# Altium project АСК_2.PrjPcb
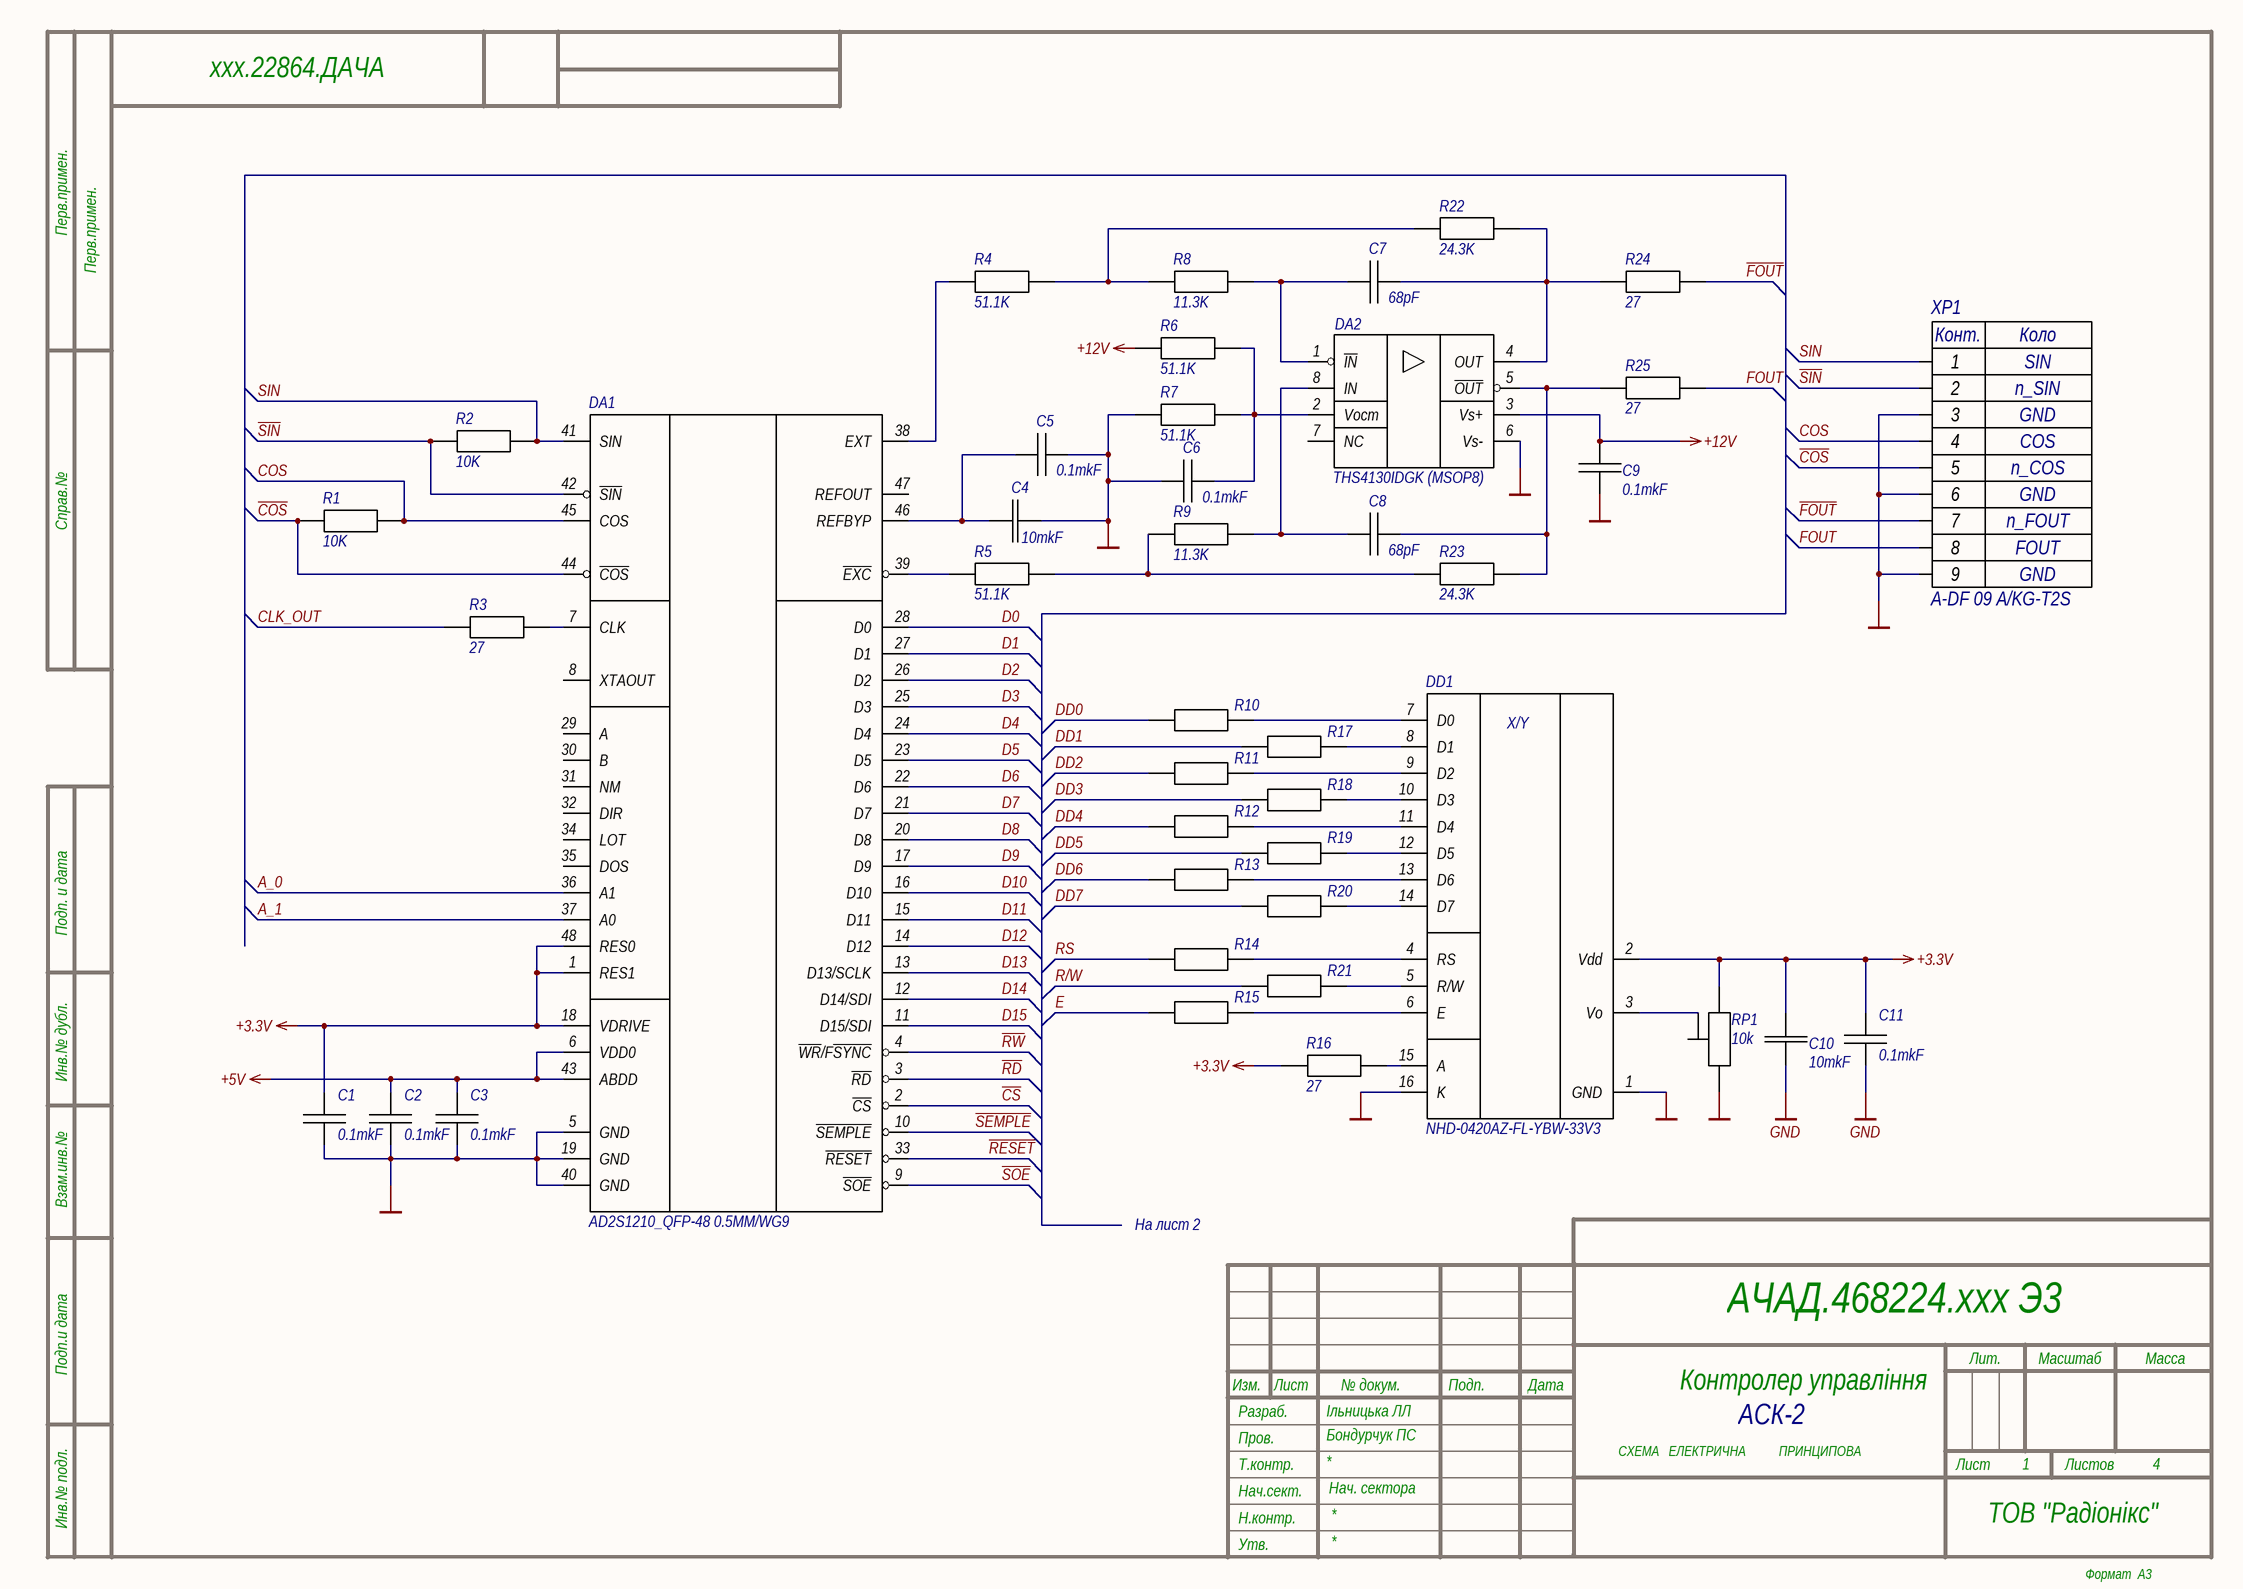
[diagram p0: Sheet1.SchDoc]
7 sheets, 214 parts. Net scope: global (net labels, ports and power ports of the same name join across sheets).
Sheets:
  Sheet1.SchDoc
  Sheet2.SchDoc
  Sheet3.SchDoc
  Sheet4.SchDoc
  ACK_2_Sheet6.SchDoc
  Sheet5.SchDoc
  ACR_2_Sheet7.SchDoc

## Sheet Sheet1.SchDoc
size 420 x 297 mm; CheckedBy: Бондурчук ПС; Author: Ільницька ЛЛ; CompanyName: ТОВ "Радіонікс"; SheetNumber: 1; SheetTotal: 4; DecimalNumber: АЧАД.468224.ххх Э3; HeadOfSector: Нач. сектора; MainDevice: Перв.примен.; Name: Контролер управління; DecimalNumber_MIRROR: ххх.22864.ДАЧА; ЕСКД_Децимальний_номер: АЧАД.468224.ххх Э3; ЕСКД_Назва_схеми_1: Схема електрична; ЕСКД_Назва_схеми_2: принципова; ЕСКД_Лист: 1; ЕСКД_Листів: 4; ЕСКД_Назва_пристрою_1: Система контроля; ЕСКД_Назва_пристрою_2: АСК-2; ЕСКД_Організація: ТОВ "Радіонікс"; PageSetup: Record=PageOptions|CenterHorizontal=True|CenterVertical=True|PrintScale=0.98|XCorrection=1.00|YCorrection=1.00|PrintKind=1|BorderSize=5000000|LeftOffset=0|BottomOffset=0|Orientation=2|PaperLength=1000|PaperWidth=1000|Scale=100|PaperSource=15|PrintQuality=1200|MediaType=1|DitherType=10|PrintScaleMode=1|PaperKind=A3|PaperIndex=8

### Parts
C1  0.1mkF  [C_0603]
C2  0.1mkF  [C_0603]
C3  0.1mkF  [C_0603]
C4  10mkF  [C_1206]
C5  0.1mkF  [C_0603]
C6  0.1mkF  [C_0603]
C7  68pF  [C_0603]
C8  68pF  [C_0603]
C9  0.1mkF  [C_0603]
C10  10mkF  [C_1206]
C11  0.1mkF  [C_0603]
DA1  AD2S1210_QFP-48 0.5MM/WG9  [QFP-48 0.5MM/WG9]
DA2  THS4130IDGK (MSOP8)  [THS4130IDGK(MSOP8)]
DD1  NHD-0420AZ-FL-YBW-33V3  [NHD-0420AZ-FL-YBW-33V3-ND]
R1  10K  [R_0603]
R2  10K  [R_0603]
R3  27  [R_0603]
R4  51.1K  [R_0603]
R5  51.1K  [R_0603]
R6  51.1K  [R_0603]
R7  51.1K  [R_0603]
R8  11.3K  [R_0603]
R9  11.3K  [R_0603]
R10  27  [R_0603]  (value not drawn)
R11  27  [R_0603]  (value not drawn)
R12  27  [R_0603]  (value not drawn)
R13  27  [R_0603]  (value not drawn)
R14  27  [R_0603]  (value not drawn)
R15  27  [R_0603]  (value not drawn)
R16  27  [R_1206]
R17  27  [R_0603]  (value not drawn)
R18  27  [R_0603]  (value not drawn)
R19  27  [R_0603]  (value not drawn)
R20  27  [R_0603]  (value not drawn)
R21  27  [R_0603]  (value not drawn)
R22  24.3K  [R_0603]
R23  24.3K  [R_0603]
R24  27  [R_0603]
R25  27  [R_0603]
RP1  10k  [RES_TRIMMER_3361P-1-103GLF]
XP1  A-DF 09 A/KG-T2S

### Nets
+3.3V: C1.2 C10.2 C11.2 DA1.1(RES1) DA1.18(VDRIVE) DA1.48(RES0) DD1.2(Vdd) R16.1 RP1.2
+5V: C2.2 C3.2 DA1.6(VDD0) DA1.43(ABDD)
+12V: C9.1 DA2.3(Vs+) R6.1
GND: C1.1 C2.1 C3.1 C4.2 C5.1 C6.2 C9.2 C10.1 C11.1 DA1.5(GND) DA1.19(GND) DA1.40(GND) DA2.6(Vs-) DD1.1(GND) DD1.16(K) R7.1 RP1.1 XP1.3 XP1.6 XP1.9
A_0: DA1.36(A1)
A_1: DA1.37(A0)
~{COS}: DA1.44(~{COS}) R1.2 XP1.5
~{CS}: DA1.2(~{CS})
CLK_OUT: R3.1
COS: DA1.45(COS) R1.1 XP1.4
D0: DA1.28(D0)
D1: DA1.27(D1)
D2: DA1.26(D2)
D3: DA1.25(D3)
D4: DA1.24(D4)
D5: DA1.23(D5)
D6: DA1.22(D6)
D7: DA1.21(D7)
D8: DA1.20(D8)
D9: DA1.17(D9)
D10: DA1.16(D10)
D11: DA1.15(D11)
D12: DA1.14(D12)
D13: DA1.13(D13/SCLK)
D14: DA1.12(D14/SDI)
D15: DA1.11(D15/SDI)
DD0: R10.1
DD1: R17.1
DD2: R11.1
DD3: R18.1
DD4: R12.1
DD5: R19.1
DD6: R13.1
DD7: R20.1
E: R15.1
~{FOUT}: R24.2 XP1.7
FOUT: R25.2 XP1.8
R/W: R21.1
~{RD}: DA1.3(~{RD})
~{RESET}: DA1.33(~{RESET})
~{RW}: DA1.4(~{WR}/F~{SYNC})
RS: R14.1
~{SEMPLE}: DA1.10(~{SEMPLE})
~{SIN}: DA1.42(~{SIN}) R2.1 XP1.2
~{SOE}: DA1.9(~{SOE})
SIN: DA1.41(SIN) R2.2 XP1.1
NetC4_1: C4.1 C5.2 DA1.46(REFBYP)
NetC6_1: C6.1 DA2.2(Vocm) R6.2 R7.2
NetC7_1: C7.1 DA2.4(OUT) R22.2 R24.1
NetC7_2: C7.2 DA2.1(~{IN}) R8.2
NetC8_1: C8.1 DA2.5(~{OUT}) R23.1 R25.1
NetC8_2: C8.2 DA2.8(IN) R9.2
NetDA1_7: DA1.7(CLK) R3.2
NetDA1_38: DA1.38(EXT) R4.1
NetDA1_39: DA1.39(~{EXC}) R5.1
NetDD1_3: DD1.3(Vo) RP1.3
NetDD1_4: DD1.4(RS) R14.2
NetDD1_5: DD1.5(R/W) R21.2
NetDD1_6: DD1.6(E) R15.2
NetDD1_7: DD1.7(D0) R10.2
NetDD1_8: DD1.8(D1) R17.2
NetDD1_9: DD1.9(D2) R11.2
NetDD1_10: DD1.10(D3) R18.2
NetDD1_11: DD1.11(D4) R12.2
NetDD1_12: DD1.12(D5) R19.2
NetDD1_13: DD1.13(D6) R13.2
NetDD1_14: DD1.14(D7) R20.2
NetDD1_15: DD1.15(A) R16.2
NetR4_2: R4.2 R8.1 R22.1
NetR5_2: R5.2 R9.1 R23.2

Not connected (* = marked no-connect by the designer): DA1 8(XTAOUT) 29(A) 30(B) 31(NM) 32(DIR) 34(LOT) 35(DOS) 47(REFOUT); DA2 7(NC)

### Notes on the sheet
- SIN
- n_SIN
- COS
- n_COS
- GND
- n_FOUT
- FOUT
- На лист 2
- АСК-2
- Перв.примен.
- Справ.№
- Подп. и дата
- Инв.№ дубл.
- Взам.инв.№
- Подп.и дата
- Разраб.
- Изм.
- Лист
- № докум.
- Подп.
- Дата
- Лит.
- Масштаб
- Масса
- Т.контр.
- Пров.
- СХЕМА   ЕЛЕКТРИЧНА
- ПРИНЦИПОВА
- Листов
- Инв.№ подл.
- Утв.
- Н.контр.
- Нач.сект.
- Формат  A3
- (in symbol A-DF 09 A/KG-T2S) Конт.; Коло
- (in symbol NHD-0420AZ-FL-YBW-33V3) X/Y

### Library data of the parts
C1-C3 C5-C9 C11 = C_0.1mkF_0603
  C1-C3 C5 C6 C9 C11: Value: 0.1mkF
  C7 C8: Value: 68pF
C4 C10 = C_10mkF_1206: Value: 10mkF
R1-R15 R17-R25 = R_100_0603
  R1 R2: Value: 10K
  R3 R10-R15 R17-R21 R24 R25: Value: 27
  R4-R7: Value: 51.1K
  R8 R9: Value: 11.3K
  R22 R23: Value: 24.3K
R16 = R_10_1206: Value: 27
RP1 = R_10k_RES_TRIMMER: R_10k_RES_TRIMMER_3361P-1-103GLF; Value: 10k
DA1 = AD2S1210_QFP-48 0.5MM/WG9: Case: QFP-48 0.5MM/WG9

## Sheet Sheet2.SchDoc
size 420 x 297 mm; SheetNumber: 2; PageSetup: Record=PageOptions|CenterHorizontal=True|CenterVertical=True|PrintScale=0.49|XCorrection=1.00|YCorrection=1.00|PrintKind=1|BorderSize=5000000|LeftOffset=0|BottomOffset=0|Orientation=2|PaperLength=1000|PaperWidth=1000|Scale=100|PaperSource=7|PrintQuality=-4|MediaType=1|DitherType=10|PrintScaleMode=1|PaperKind=A4; DecimalNumber: АЧАД.468224.ххх Э3; HeadOfSector: Нач. сектора; MainDevice: Перв.примен.; Name: Наименование; DecimalNumber_MIRROR: Э3 ххх.422.864.ДАЧА
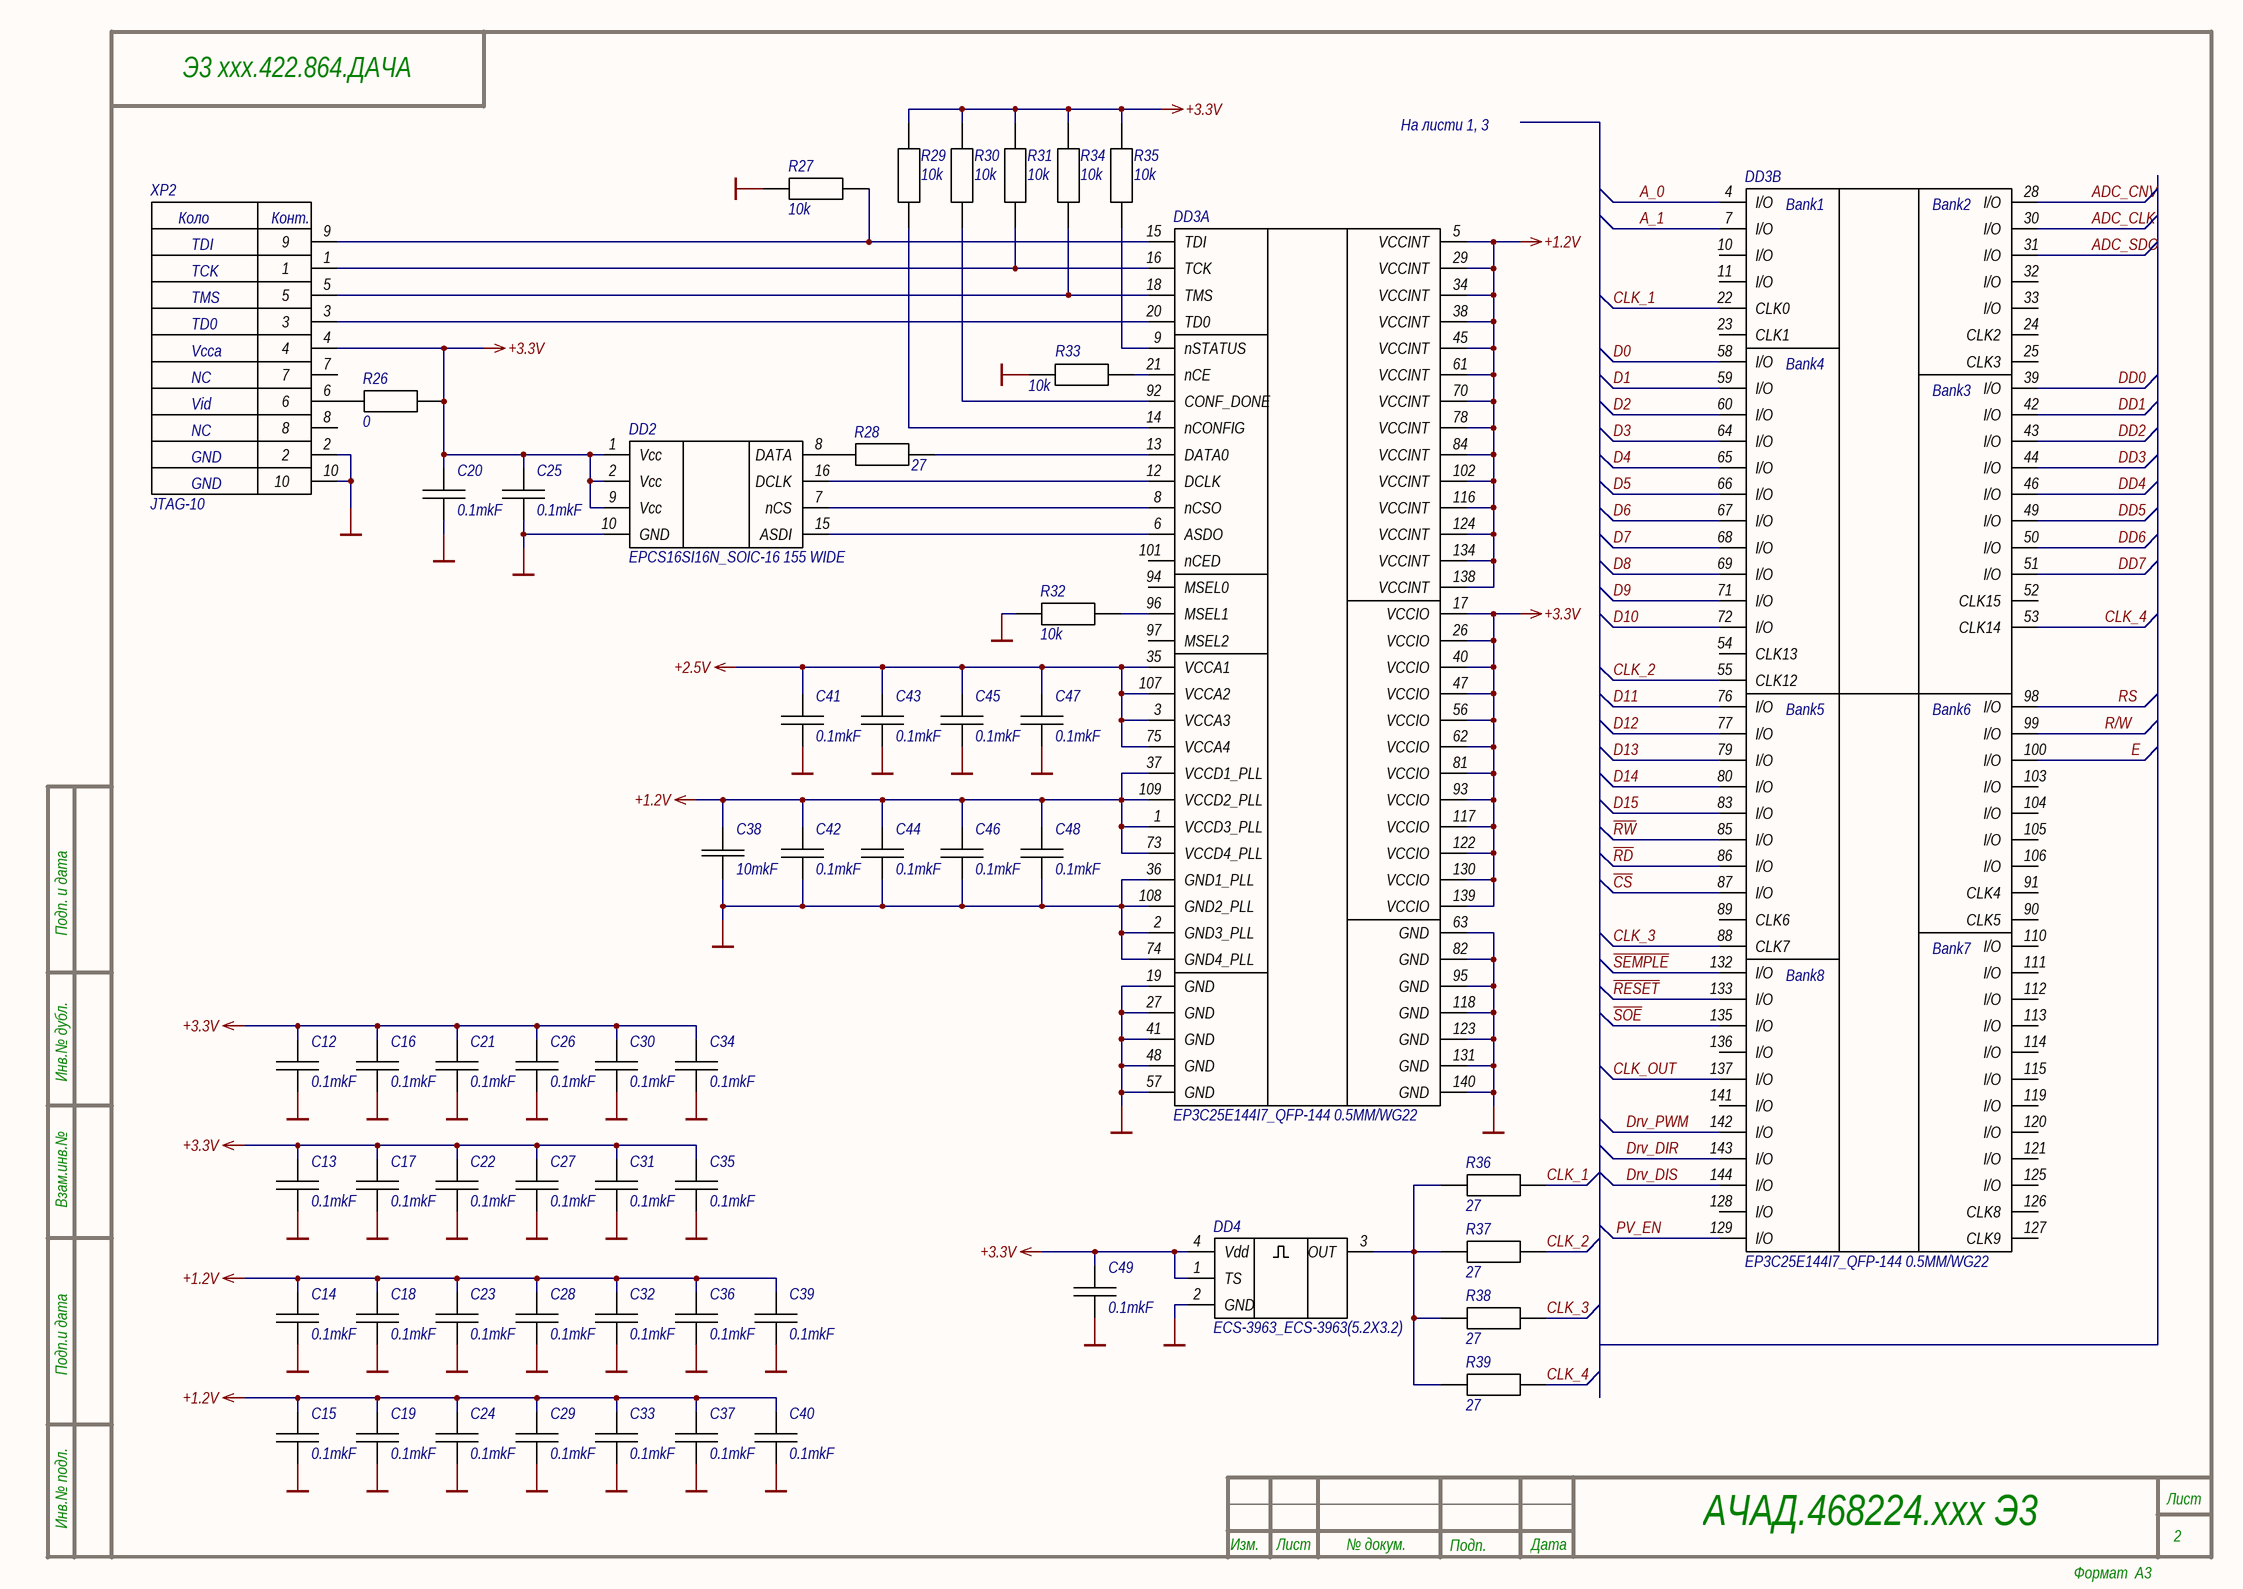
[diagram p1: Sheet2.SchDoc]

### Parts
C12  0.1mkF  [C_0603]
C13  0.1mkF  [C_0603]
C14  0.1mkF  [C_0603]
C15  0.1mkF  [C_0603]
C16  0.1mkF  [C_0603]
C17  0.1mkF  [C_0603]
C18  0.1mkF  [C_0603]
C19  0.1mkF  [C_0603]
C20  0.1mkF  [C_0603]
C21  0.1mkF  [C_0603]
C22  0.1mkF  [C_0603]
C23  0.1mkF  [C_0603]
C24  0.1mkF  [C_0603]
C25  0.1mkF  [C_0603]
C26  0.1mkF  [C_0603]
C27  0.1mkF  [C_0603]
C28  0.1mkF  [C_0603]
C29  0.1mkF  [C_0603]
C30  0.1mkF  [C_0603]
C31  0.1mkF  [C_0603]
C32  0.1mkF  [C_0603]
C33  0.1mkF  [C_0603]
C34  0.1mkF  [C_0603]
C35  0.1mkF  [C_0603]
C36  0.1mkF  [C_0603]
C37  0.1mkF  [C_0603]
C38  10mkF  [C_1206]
C39  0.1mkF  [C_0603]
C40  0.1mkF  [C_0603]
C41  0.1mkF  [C_0603]
C42  0.1mkF  [C_0603]
C43  0.1mkF  [C_0603]
C44  0.1mkF  [C_0603]
C45  0.1mkF  [C_0603]
C46  0.1mkF  [C_0603]
C47  0.1mkF  [C_0603]
C48  0.1mkF  [C_0603]
C49  0.1mkF  [C_0603]
DD2  EPCS16SI16N_SOIC-16 155 WIDE  [SOIC127P600X175-16N]
DD3  EP3C25E144I7_QFP-144 0.5MM/WG22  [QFP65P3122X3122X395-144N]  (parts A,B of 2)
DD4  ECS-3963_ECS-3963(5.2X3.2)  [ECS-3961]
R26  0  [R_1206]
R27  10k  [R_0603]
R28  27  [R_1206]
R29  10k  [R_0603]
R30  10k  [R_0603]
R31  10k  [R_0603]
R32  10k  [R_0603]
R33  10k  [R_0603]
R34  10k  [R_0603]
R35  10k  [R_0603]
R36  27  [R_0603]
R37  27  [R_0603]
R38  27  [R_0603]
R39  27  [R_0603]
XP2  JTAG-10

### Nets
+1.2V: C14.2 C15.2 C18.2 C19.2 C23.2 C24.2 C28.2 C29.2 C32.2 C33.2 C36.2 C37.2 C38.2 C39.2 C40.2 C42.2 C44.2 C46.2 C48.2 DD3.1(VCCD3_PLL) DD3.5(VCCINT) DD3.29(VCCINT) DD3.34(VCCINT) DD3.37(VCCD1_PLL) DD3.38(VCCINT) DD3.45(VCCINT) DD3.61(VCCINT) DD3.70(VCCINT) DD3.73(VCCD4_PLL) DD3.78(VCCINT) DD3.84(VCCINT) DD3.102(VCCINT) DD3.109(VCCD2_PLL) DD3.116(VCCINT) DD3.124(VCCINT) DD3.134(VCCINT) DD3.138(VCCINT)
+2.5V: C41.2 C43.2 C45.2 C47.2 DD3.3(VCCA3) DD3.35(VCCA1) DD3.75(VCCA4) DD3.107(VCCA2)
+3.3V: C12.2 C13.2 C16.2 C17.2 C20.2 C21.2 C22.2 C25.2 C26.2 C27.2 C30.2 C31.2 C34.2 C35.2 C49.2 DD2.1(Vcc) DD2.2(Vcc) DD2.9(Vcc) DD3.17(VCCIO) DD3.26(VCCIO) DD3.40(VCCIO) DD3.47(VCCIO) DD3.56(VCCIO) DD3.62(VCCIO) DD3.81(VCCIO) DD3.93(VCCIO) DD3.117(VCCIO) DD3.122(VCCIO) DD3.130(VCCIO) DD3.139(VCCIO) DD4.1(TS) DD4.4(Vdd) R26.1 R29.2 R30.2 R31.2 R34.2 R35.2 XP2.4
GND: C12.1 C13.1 C14.1 C15.1 C16.1 C17.1 C18.1 C19.1 C20.1 C21.1 C22.1 C23.1 C24.1 C25.1 C26.1 C27.1 C28.1 C29.1 C30.1 C31.1 C32.1 C33.1 C34.1 C35.1 C36.1 C37.1 C38.1 C39.1 C40.1 C41.1 C42.1 C43.1 C44.1 C45.1 C46.1 C47.1 C48.1 C49.1 DD2.10(GND) DD3.2(GND3_PLL) DD3.19(GND) DD3.27(GND) DD3.36(GND1_PLL) DD3.41(GND) DD3.48(GND) DD3.57(GND) DD3.63(GND) DD3.74(GND4_PLL) DD3.82(GND) DD3.95(GND) DD3.108(GND2_PLL) DD3.118(GND) DD3.123(GND) DD3.131(GND) DD3.140(GND) DD4.2(GND) R27.1 R32.1 R33.1 XP2.2 XP2.10
PV_EN: DD3.129(I/O)
A_0: DD3.4(I/O)
A_1: DD3.7(I/O)
ADC_CLK: DD3.30(I/O)
ADC_CNV: DD3.28(I/O)
ADC_SDO: DD3.31(I/O)
~{CS}: DD3.87(I/O)
CLK_1: DD3.22(CLK0) R36.2
CLK_2: DD3.55(CLK12) R37.2
CLK_3: DD3.88(CLK7) R38.2
CLK_4: DD3.53(CLK14) R39.2
CLK_OUT: DD3.137(I/O)
D0: DD3.58(I/O)
D1: DD3.59(I/O)
D2: DD3.60(I/O)
D3: DD3.64(I/O)
D4: DD3.65(I/O)
D5: DD3.66(I/O)
D6: DD3.67(I/O)
D7: DD3.68(I/O)
D8: DD3.69(I/O)
D9: DD3.71(I/O)
D10: DD3.72(I/O)
D11: DD3.76(I/O)
D12: DD3.77(I/O)
D13: DD3.79(I/O)
D14: DD3.80(I/O)
D15: DD3.83(I/O)
DD0: DD3.39(I/O)
DD1: DD3.42(I/O)
DD2: DD3.43(I/O)
DD3: DD3.44(I/O)
DD4: DD3.46(I/O)
DD5: DD3.49(I/O)
DD6: DD3.50(I/O)
DD7: DD3.51(I/O)
Drv_DIR: DD3.143(I/O)
Drv_DIS: DD3.144(I/O)
Drv_PWM: DD3.142(I/O)
E: DD3.100(I/O)
R/W: DD3.99(I/O)
~{RD}: DD3.86(I/O)
~{RESET}: DD3.133(I/O)
~{RW}: DD3.85(I/O)
RS: DD3.98(I/O)
~{SEMPLE}: DD3.132(I/O)
~{SOE}: DD3.135(I/O)
NetDD2_7: DD2.7(nCS) DD3.8(nCSO)
NetDD2_8: DD2.8(DATA) R28.1
NetDD2_15: DD2.15(ASDI) DD3.6(ASDO)
NetDD2_16: DD2.16(DCLK) DD3.12(DCLK)
NetDD3_9: DD3.9(nSTATUS) R35.1
NetDD3_13: DD3.13(DATA0) R28.2
NetDD3_14: DD3.14(nCONFIG) R29.1
NetDD3_15: DD3.15(TDI) R27.2 XP2.9
NetDD3_16: DD3.16(TCK) R31.1 XP2.1
NetDD3_18: DD3.18(TMS) R34.1 XP2.5
NetDD3_20: DD3.20(TD0) XP2.3
NetDD3_21: DD3.21(nCE) R33.2
NetDD3_92: DD3.92(CONF_DONE) R30.1
NetDD3_96: DD3.96(MSEL1) R32.2
NetDD4_3: DD4.3(OUT) R36.1 R37.1 R38.1 R39.1
NetR26_2: R26.2 XP2.6

Not connected (* = marked no-connect by the designer): DD3 10(I/O) 11(I/O) 23(CLK1) 24(CLK2) 25(CLK3) 32(I/O) 33(I/O) 52(CLK15) 54(CLK13) 89(CLK6) 90(CLK5) 91(CLK4) 94(MSEL0) 97(MSEL2) 101(nCED) 103(I/O) 104(I/O) 105(I/O) 106(I/O) 110(I/O) 111(I/O) 112(I/O) 113(I/O) 114(I/O) 115(I/O) 119(I/O) 120(I/O) 121(I/O) 125(I/O) 126(CLK8) 127(CLK9) 128(I/O) 136(I/O) 141(I/O); XP2 7 8

### Notes on the sheet
- На листи 1, 3
- Подп. и дата
- Инв.№ дубл.
- Взам.инв.№
- Подп.и дата
- Инв.№ подл.
- Изм.
- Лист
- № докум.
- Подп.
- Дата
- Формат  A3
- (in symbol EP3C25E144I7_QFP-144 0.5MM/WG22, part B) Bank1; Bank2; Bank4; Bank3; Bank5; Bank6; Bank7; Bank8
- (in symbol JTAG-10) Коло; Конт.; TDI; TCK; TMS; TD0; Vcca; NC; Vid; GND

### Library data of the parts
C12-C37 C39-C49 = C_0.1mkF_0603: Value: 0.1mkF
C38 = C_10mkF_1206: Value: 10mkF
R26 R28 = R_10_1206
  R26: Value: 0
  R28: Value: 27
R27 R29-R39 = R_10k_0603
  R27 R29-R35: Value: 10k
  R36-R39: Value: 27

## Sheet Sheet3.SchDoc
size 420 x 297 mm; SheetNumber: 3; ЕСКД_Децимальний_номер: ААЭД.468224.ххх Э3; ЕСКД_Лист: 3; PageSetup: Record=PageOptions|CenterHorizontal=True|CenterVertical=True|PrintScale=0.70|XCorrection=1.00|YCorrection=1.00|PrintKind=1|BorderSize=5000000|LeftOffset=0|BottomOffset=0|Orientation=2|PaperLength=1000|PaperWidth=1000|Scale=100|PaperSource=7|PrintQuality=600|MediaType=1|DitherType=10|PrintScaleMode=1|PaperKind=A4|PaperIndex=9; DecimalNumber: АЧАД.468224.ххх Э3; HeadOfSector: Нач. сектора; MainDevice: Перв.примен.; Name: Наименование; DecimalNumber_MIRROR: 3Э ххх.422864.ДАЧА
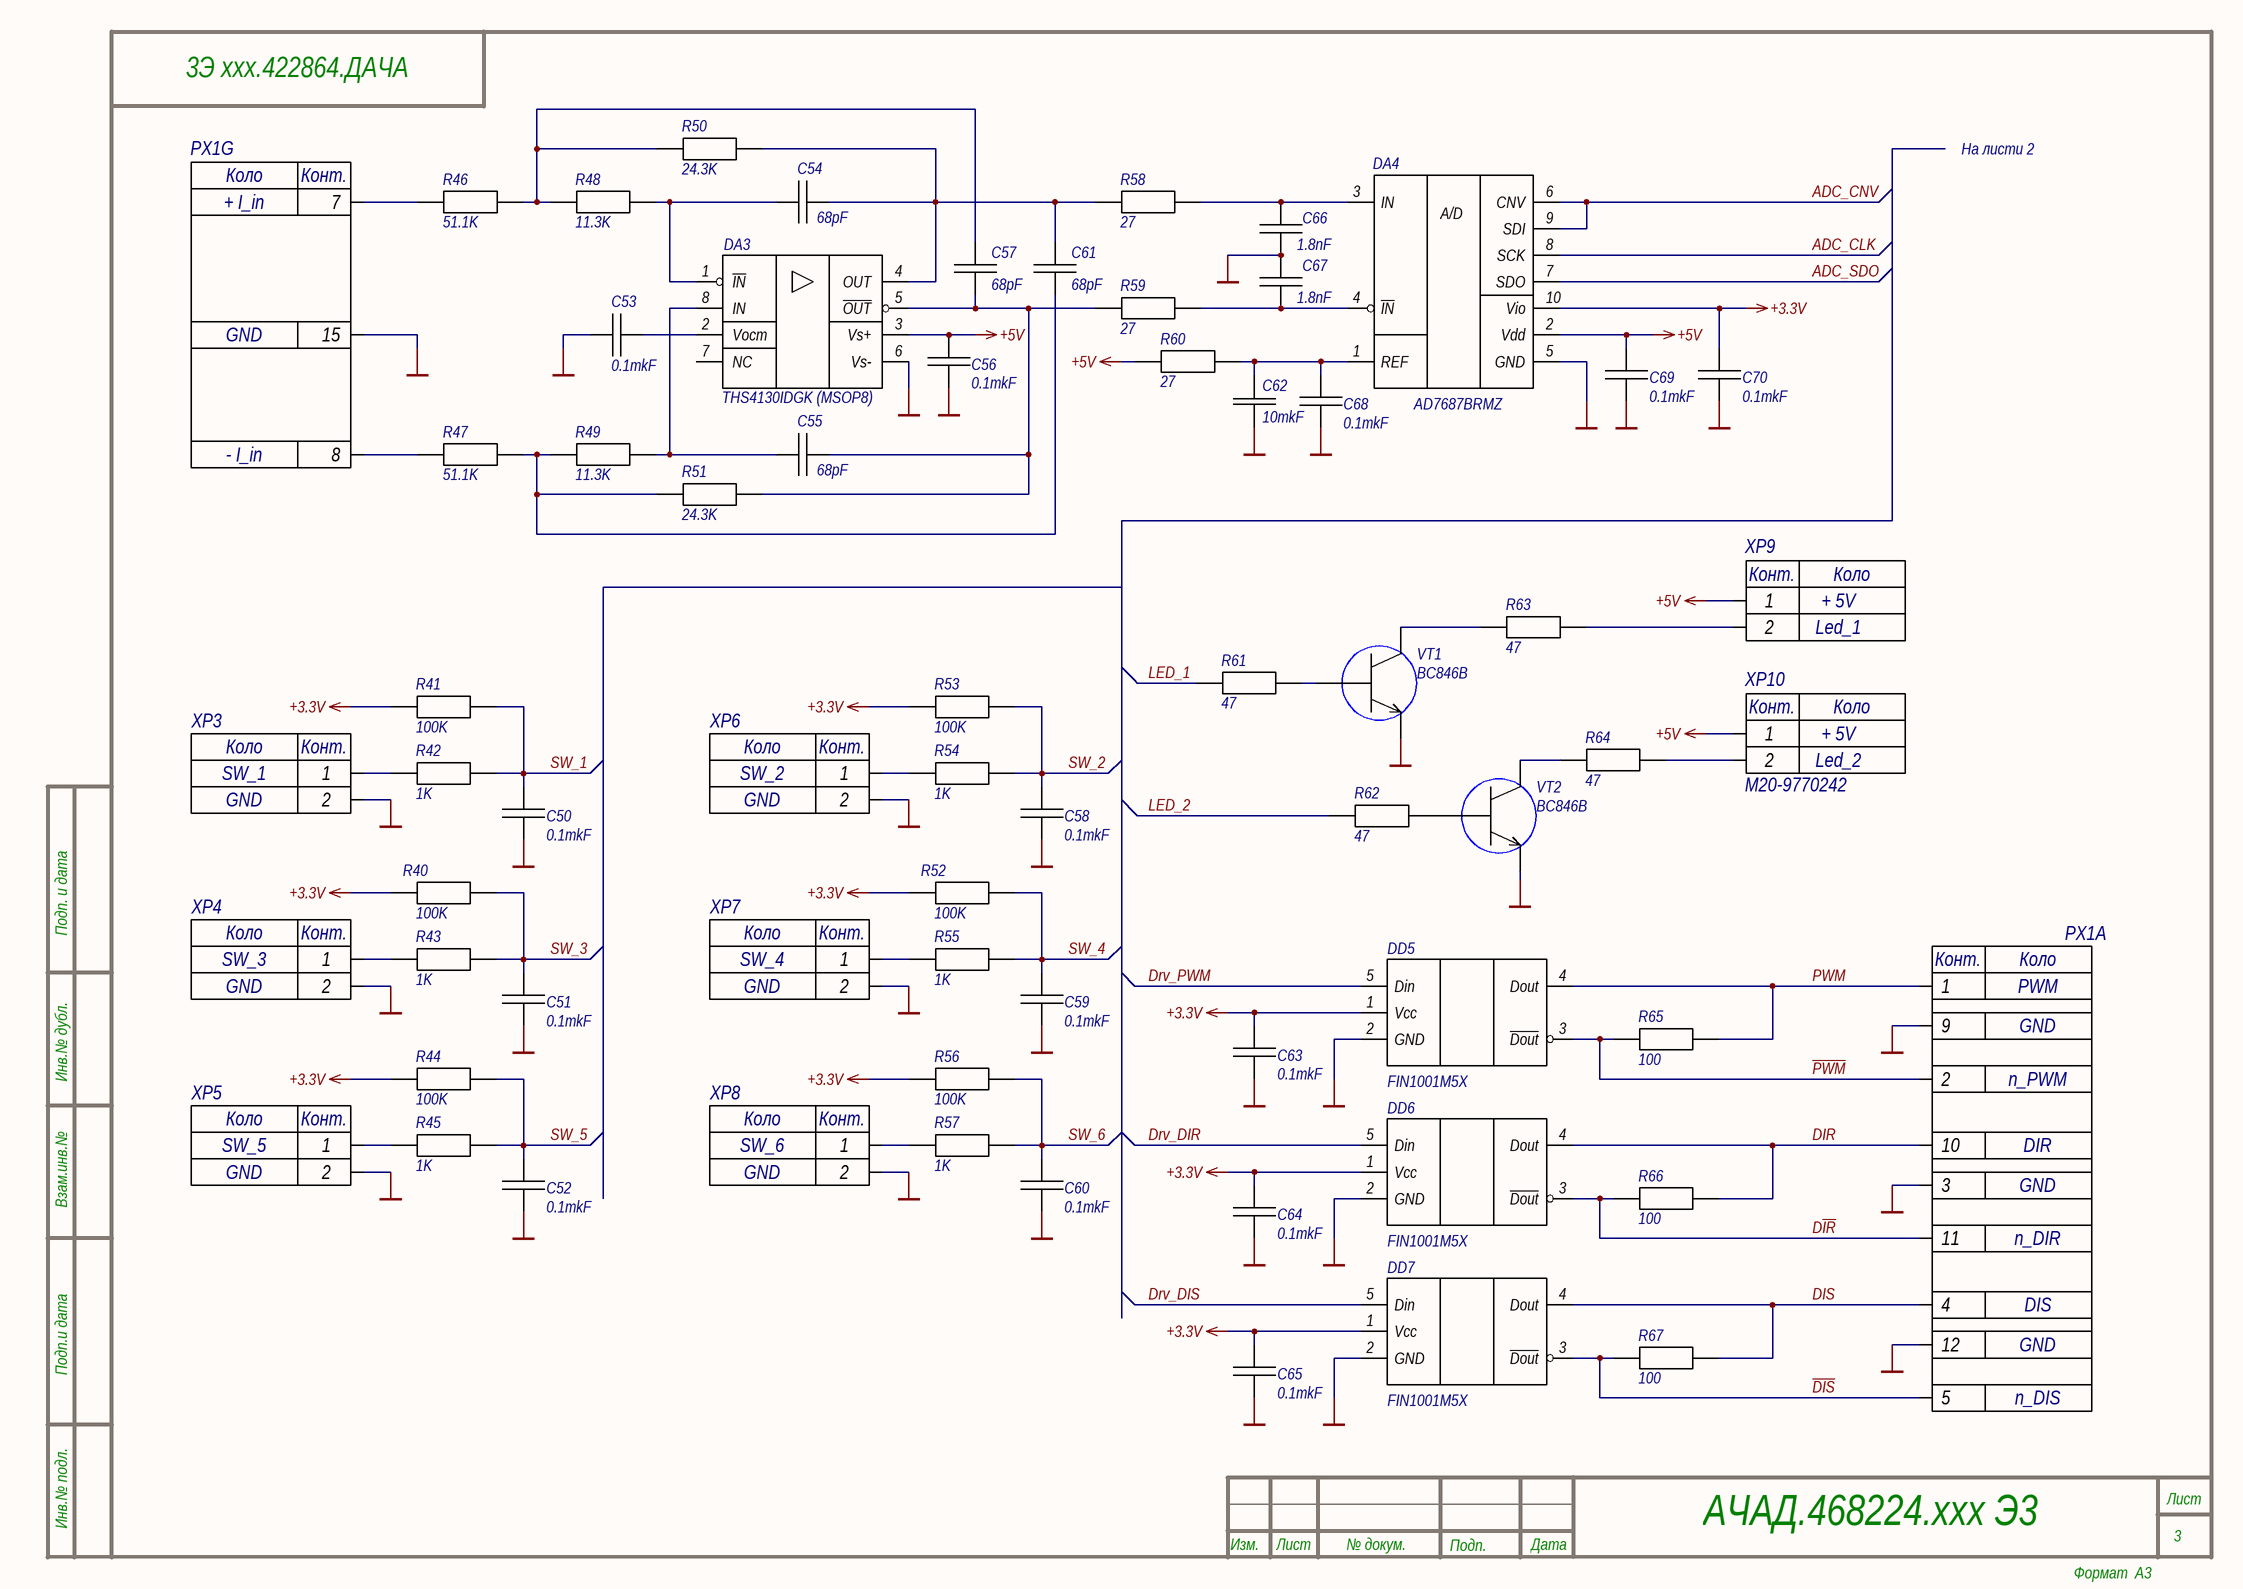
[diagram p2: Sheet3.SchDoc]

### Parts
C50  0.1mkF  [C_0603]
C51  0.1mkF  [C_0603]
C52  0.1mkF  [C_0603]
C53  0.1mkF  [C_0603]
C54  68pF  [C_0603]
C55  68pF  [C_0603]
C56  0.1mkF  [C_0603]
C57  68pF  [C_0603]
C58  0.1mkF  [C_0603]
C59  0.1mkF  [C_0603]
C60  0.1mkF  [C_0603]
C61  68pF  [C_0603]
C62  10mkF  [C_1206]
C63  0.1mkF  [C_0603]
C64  0.1mkF  [C_0603]
C65  0.1mkF  [C_0603]
C66  1.8nF  [C_0603]
C67  1.8nF  [C_0603]
C68  0.1mkF  [C_0603]
C69  0.1mkF  [C_0603]
C70  0.1mkF  [C_0603]
DA3  THS4130IDGK (MSOP8)  [THS4130IDGK(MSOP8)]
DA4  AD7687BRMZ
DD5  FIN1001M5X
DD6  FIN1001M5X
DD7  FIN1001M5X
PX1  DB_15  (value not drawn)  (parts A,B,C,D,E,G,H,I,J,K,L,O of 15)
R40  100K  [R_0603]
R41  100K  [R_0603]
R42  1K  [R_0603]
R43  1K  [R_0603]
R44  100K  [R_0603]
R45  1K  [R_0603]
R46  51.1K  [R_0603]
R47  51.1K  [R_0603]
R48  11.3K  [R_0603]
R49  11.3K  [R_0603]
R50  24.3K  [R_0603]
R51  24.3K  [R_0603]
R52  100K  [R_0603]
R53  100K  [R_0603]
R54  1K  [R_0603]
R55  1K  [R_0603]
R56  100K  [R_0603]
R57  1K  [R_0603]
R58  27  [R_0603]
R59  27  [R_0603]
R60  27  [R_0603]
R61  47  [R_0603]
R62  47  [R_0603]
R63  47  [R_0603]
R64  47  [R_0603]
R65  100  [R_0603]
R66  100  [R_0603]
R67  100  [R_0603]
VT1  BC846B  [SOT95P245X110 3N]
VT2  BC846B  [SOT95P245X110 3N]
XP3  M20-9770242  (value not drawn)
XP4  M20-9770242  (value not drawn)
XP5  M20-9770242  (value not drawn)
XP6  M20-9770242  (value not drawn)
XP7  M20-9770242  (value not drawn)
XP8  M20-9770242  (value not drawn)
XP9  M20-9770242  (value not drawn)
XP10  M20-9770242

### Nets
+3.3V: C63.1 C64.1 C65.1 C70.1 DA4.10(Vio) DD5.1(Vcc) DD6.1(Vcc) DD7.1(Vcc) R40.1 R41.1 R44.1 R52.1 R53.1 R56.1
+5V: C56.1 C69.1 DA3.3(Vs+) DA4.2(Vdd) R60.1 XP9.1 XP10.1
GND: C50.2 C51.2 C52.2 C53.1 C56.2 C58.2 C59.2 C60.2 C62.1 C63.2 C64.2 C65.2 C66.2 C67.1 C68.2 C69.2 C70.2 DA3.6(Vs-) DA4.5(GND) DD5.2(GND) DD6.2(GND) DD7.2(GND) PX1.3 PX1.9 PX1.12 PX1.15 VT1.2 VT2.2 XP3.2 XP4.2 XP5.2 XP6.2 XP7.2 XP8.2
ADC_CLK: DA4.8(SCK)
ADC_CNV: DA4.6(CNV) DA4.9(SDI)
ADC_SDO: DA4.7(SDO)
~{DIS}: DD7.3(~{Dout}) PX1.5 R67.1
D~{I}~{R}: DD6.3(~{Dout}) PX1.11 R66.1
DIR: DD6.4(Dout) PX1.10 R66.2
DIS: DD7.4(Dout) PX1.4 R67.2
Drv_DIR: DD6.5(Din)
Drv_DIS: DD7.5(Din)
Drv_PWM: DD5.5(Din)
LED_1: R61.1
LED_2: R62.1
~{PWM}: DD5.3(~{Dout}) PX1.1(2) R65.1
PWM: DD5.4(Dout) PX1.1 R65.2
SW_1: C50.1 R41.2 R42.2
SW_2: C58.1 R53.2 R54.2
SW_3: C51.1 R40.2 R43.2
SW_4: C59.1 R52.2 R55.2
SW_5: C52.1 R44.2 R45.2
SW_6: C60.1 R56.2 R57.2
NetC53_2: C53.2 DA3.2(Vocm)
NetC54_1: C54.1 C61.1 DA3.4(OUT) R50.2 R58.1
NetC54_2: C54.2 DA3.1(~{IN}) R48.2
NetC55_1: C55.1 C57.2 DA3.5(~{OUT}) R51.1 R59.1
NetC55_2: C55.2 DA3.8(IN) R49.1
NetC57_1: C57.1 R46.2 R48.1 R50.1
NetC61_2: C61.2 R47.2 R49.2 R51.2
NetC62_2: C62.2 C68.1 DA4.1(REF) R60.2
NetC66_1: C66.1 DA4.3(IN) R58.2
NetC67_2: C67.2 DA4.4(~{IN}) R59.2
NetPX1_7: PX1.7 R46.1
NetPX1_8: PX1.8 R47.1
NetR42_1: R42.1 XP3.1
NetR43_1: R43.1 XP4.1
NetR45_1: R45.1 XP5.1
NetR54_1: R54.1 XP6.1
NetR55_1: R55.1 XP7.1
NetR57_1: R57.1 XP8.1
NetR61_2: R61.2 VT1.1
NetR62_2: R62.2 VT2.1
NetR63_1: R63.1 VT1.3
NetR63_2: R63.2 XP9.2
NetR64_1: R64.1 VT2.3
NetR64_2: R64.2 XP10.2

Not connected (* = marked no-connect by the designer): DA3 7(NC)

### Notes on the sheet
- Коло
- (near PX1) Конт.
- На листи 2
- + I_in
- GND
- - I_in
- + 5V
- Led_1
- SW_1
- SW_2
- Led_2
- SW_3
- SW_4
- PWM
- n_PWM
- SW_5
- SW_6
- DIR
- n_DIR
- DIS
- n_DIS
- Подп. и дата
- Инв.№ дубл.
- Взам.инв.№
- Подп.и дата
- Инв.№ подл.
- Изм.
- Лист
- № докум.
- Подп.
- Дата
- Формат  A3
- (in symbol AD7687BRMZ) A/D
- (in symbol M20-9770242) Конт.; Коло

### Library data of the parts
C50-C61 C63-C70 = C_0.1mkF_0603
  C50-C53 C56 C58-C60 C63-C65 C68-C70: Value: 0.1mkF
  C54 C55 C57 C61: Value: 68pF
  C66 C67: Value: 1.8nF
C62 = C_10mkF_1206: Value: 10mkF
R40-R67 = R_100_0603
  R40 R41 R44 R52 R53 R56: Value: 100K
  R42 R43 R45 R54 R55 R57: Value: 1K
  R46 R47: Value: 51.1K
  R48 R49: Value: 11.3K
  R50 R51: Value: 24.3K
  R58-R60: Value: 27
  R61-R64: Value: 47
  R65-R67: Value: 100

## Sheet Sheet4.SchDoc
size 420 x 297 mm; SheetNumber: 4; : ААЭД.468224.ххх Э3; PageSetup: Record=PageOptions|CenterHorizontal=True|CenterVertical=True|PrintScale=0.47|XCorrection=1.00|YCorrection=1.00|PrintKind=1|BorderSize=5000000|LeftOffset=0|BottomOffset=0|Orientation=1|PaperLength=1000|PaperWidth=1000|Scale=100|PaperSource=7|PrintQuality=-4|MediaType=1|DitherType=10|PrintScaleMode=1|PaperKind=A4; DecimalNumber: АЧАД.468224.ххх Э3; HeadOfSector: Нач. сектора; MainDevice: Перв.примен.; Name: Наименование; DecimalNumber_MIRROR: 3Э ххх.422864.ДАЧА
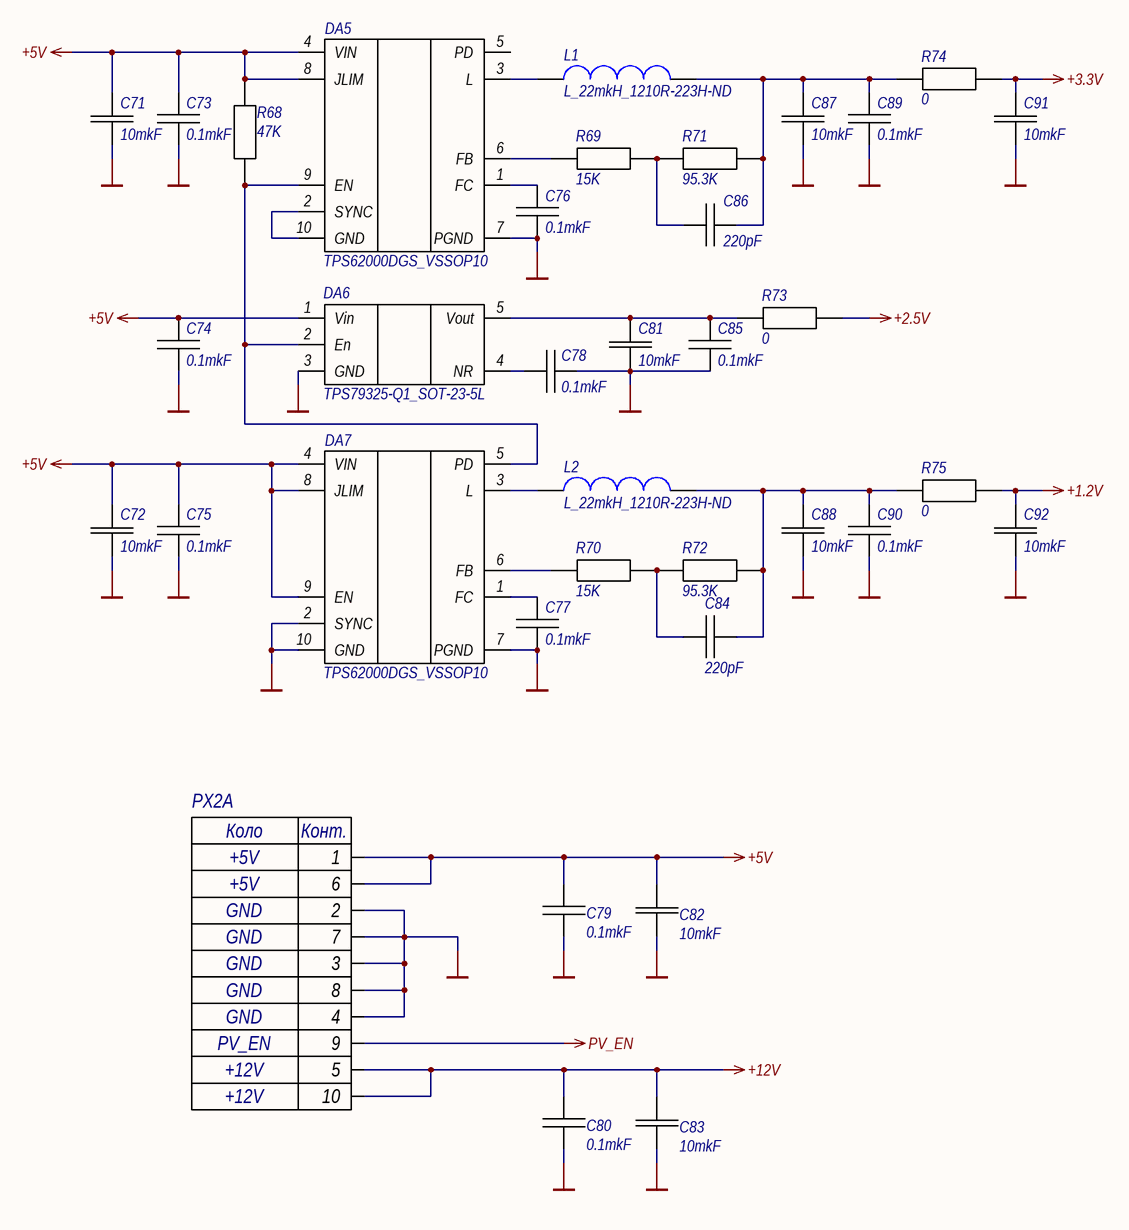
[diagram p3: Sheet4.SchDoc]

### Parts
C71  10mkF  [C_1206]
C72  10mkF  [C_1206]
C73  0.1mkF  [C_0603]
C74  0.1mkF  [C_0603]
C75  0.1mkF  [C_0603]
C76  0.1mkF  [C_0603]
C77  0.1mkF  [C_0603]
C78  0.1mkF  [C_0603]
C79  0.1mkF  [C_0603]
C80  0.1mkF  [C_0603]
C81  10mkF  [C_1206]
C82  10mkF  [C_1206]
C83  10mkF  [C_1206]
C84  220pF  [C_0603]
C85  0.1mkF  [C_0603]
C86  220pF  [C_0603]
C87  10mkF  [C_1206]
C88  10mkF  [C_1206]
C89  0.1mkF  [C_0603]
C90  0.1mkF  [C_0603]
C91  10mkF  [C_1206]
C92  10mkF  [C_1206]
DA5  TPS62000DGS_VSSOP10  [THS4130IDGK(MSOP8)]
DA6  TPS79325-Q1_SOT-23-5L  [SOT95P280X110-5N]
DA7  TPS62000DGS_VSSOP10  [THS4130IDGK(MSOP8)]
L1  L_22mkH_1210R-223H-ND  [1210R_IND]
L2  L_22mkH_1210R-223H-ND  [1210R_IND]
PX2  M80-5101042  (value not drawn)  (parts A,B,C,D,E,F,G,H,I,J of 10)
R68  47K  [R_1206]
R69  15K  [R_1206]
R70  15K  [R_1206]
R71  95.3K  [R_1206]
R72  95.3K  [R_1206]
R73  0  [R_1206]
R74  0  [R_1206]
R75  0  [R_1206]

### Nets
+1.2V: C92.2 R75.1
+2.5V: R73.1
+3.3V: C91.2 R74.1
+5V: C71.2 C72.2 C73.1 C74.1 C75.1 C79.1 C82.2 DA5.4(VIN) DA5.8(JLIM) DA6.1(Vin) DA7.4(VIN) DA7.8(JLIM) DA7.9(EN) PX2.1 PX2.6 R68.1
+12V: C80.1 C83.2 PX2.5 PX2.10
GND: C71.1 C72.1 C73.2 C74.2 C75.2 C76.2 C77.2 C78.1 C79.2 C80.2 C81.1 C82.1 C83.1 C85.2 C87.1 C88.1 C89.2 C90.2 C91.1 C92.1 DA5.7(PGND) DA6.3(GND) DA7.2(SYNC) DA7.7(PGND) DA7.10(GND) PX2.2 PX2.3 PX2.4 PX2.7 PX2.8
PV_EN: PX2.9
NetC76_1: C76.1 DA5.1(FC)
NetC77_1: C77.1 DA7.1(FC)
NetC78_2: C78.2 DA6.4(NR)
NetC81_2: C81.2 C85.1 DA6.5(Vout) R73.2
NetC84_1: C84.1 R70.1 R72.1
NetC84_2: C84.2 C88.2 C90.1 L2.2 R72.2 R75.2
NetC86_1: C86.1 R69.1 R71.1
NetC86_2: C86.2 C87.2 C89.1 L1.2 R71.2 R74.2
NetDA5_2: DA5.2(SYNC) DA5.10(GND)
NetDA5_3: DA5.3(L) L1.1
NetDA5_6: DA5.6(FB) R69.2
NetDA5_9: DA5.9(EN) DA6.2(En) DA7.5(PD) R68.2
NetDA7_3: DA7.3(L) L2.1
NetDA7_6: DA7.6(FB) R70.2

Not connected (* = marked no-connect by the designer): DA5 5(PD)

### Notes on the sheet
- Коло
- +5V
- (near PX2) Конт.
- GND
- PV_EN
- +12V
- Подп. и дата
- Инв.№ дубл.
- Взам.инв.№
- Подп.и дата
- Инв.№ подл.
- Изм.
- Лист
- № докум.
- Подп.
- Дата
- Формат  A3

### Library data of the parts
C71 C72 C81-C83 C87 C88 C91 C92 = C_10mkF_1206: Value: 10mkF
C73-C80 C84-C86 C89 C90 = C_0.1mkF_0603
  C73-C80 C85 C89 C90: Value: 0.1mkF
  C84 C86: Value: 220pF
R68-R75 = R_10_1206
  R68: Value: 47K
  R69 R70: Value: 15K
  R71 R72: Value: 95.3K
  R73-R75: Value: 0

## Sheet ACK_2_Sheet6.SchDoc
size 209 x 297 mm; CheckedBy: Бондарчук ПС; Author: Ільницька ЛЛ; CompanyName: ТОВ "Радіонікс"; SheetNumber: 1; SheetTotal: 1; ЕСКД_Децимальний_номер: ААЭД.426439.xxx Э3; ЕСКД_Назва_схеми_1: Схема електрична; ЕСКД_Назва_схеми_2: принципова; ЕСКД_Лист: 1; ЕСКД_Листів: 1; ЕСКД_Назва_пристрою_2: Клавіатура; ЕСКД_Організація: ТОВ "Радіонікс"; PageSetup: Record=PageOptions|CenterHorizontal=True|CenterVertical=True|PrintScale=0.94|XCorrection=1.00|YCorrection=1.00|PrintKind=1|BorderSize=5000000|LeftOffset=0|BottomOffset=0|Orientation=1|PaperLength=1000|PaperWidth=1000|Scale=100|PaperSource=7|PrintQuality=-4|MediaType=1|DitherType=10|PrintScaleMode=1|PaperKind=A4; DecimalNumber: АЧАД.426439.xxx Э3; HeadOfSector: Нач. сектора; MainDevice: Перв.примен.; Name: Клавіатура АСК-2
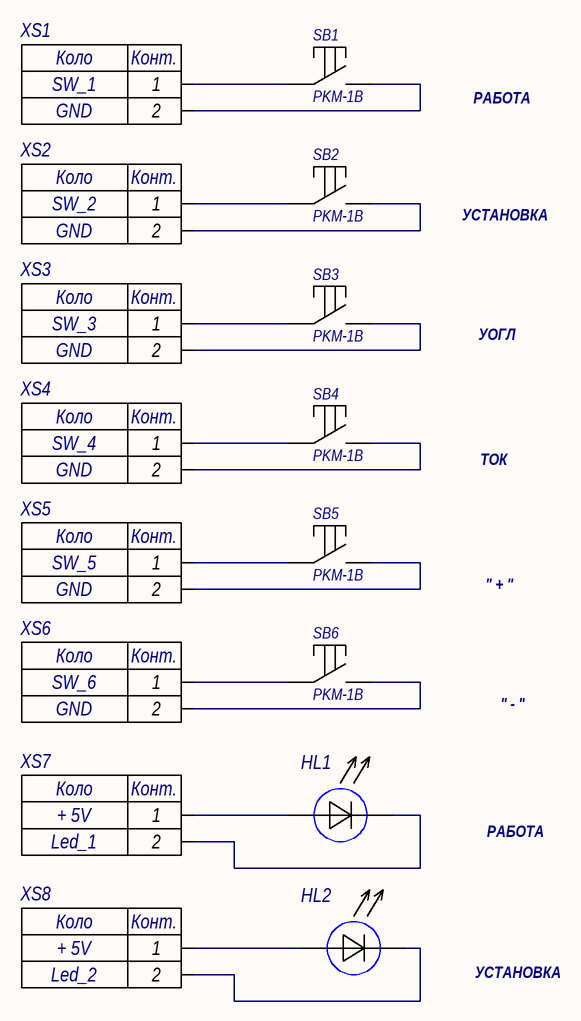
[diagram p4: ACK_2_Sheet6.SchDoc]

### Parts
HL1  LED_1  [LED_VISHAY_VLMX1]  (value not drawn)
HL2  LED_1  [LED_VISHAY_VLMX1]  (value not drawn)
SB1  PKM-1B
SB2  PKM-1B
SB3  PKM-1B
SB4  PKM-1B
SB5  PKM-1B
SB6  PKM-1B
XS1  M20-9770242  (value not drawn)
XS2  M20-9770242  (value not drawn)
XS3  M20-9770242  (value not drawn)
XS4  M20-9770242  (value not drawn)
XS5  M20-9770242  (value not drawn)
XS6  M20-9770242  (value not drawn)
XS7  M20-9770242  (value not drawn)
XS8  M20-9770242  (value not drawn)

### Nets
NetHL1_1: HL1.1 XS7.1
NetHL1_2: HL1.2 XS7.2
NetHL2_1: HL2.1 XS8.1
NetHL2_2: HL2.2 XS8.2
NetSB1_1: SB1.1 XS1.1
NetSB1_2: SB1.2 XS1.2
NetSB2_1: SB2.1 XS2.1
NetSB2_2: SB2.2 XS2.2
NetSB3_1: SB3.1 XS3.1
NetSB3_2: SB3.2 XS3.2
NetSB4_1: SB4.1 XS4.1
NetSB4_2: SB4.2 XS4.2
NetSB5_1: SB5.1 XS5.1
NetSB5_2: SB5.2 XS5.2
NetSB6_1: SB6.1 XS6.1
NetSB6_2: SB6.2 XS6.2

### Notes on the sheet
- SW_1
- GND
- РАБОТА
- SW_2
- УСТАНОВКА
- SW_3
- УОГЛ
- SW_4
- ТОК
- SW_5
- " + "
- SW_6
- " - "
- Led_1
- + 5V
- Led_2
- Перв.примен.
- Справ.№
- Подп. и дата
- Инв.№ дубл.
- Взам.инв.№
- Подп.и дата
- Разраб.
- Изм.
- Лист
- № докум.
- Подп.
- Дата
- Лит.
- Масштаб
- Масса
- Т.контр.
- Пров.
- СХЕМА   ЕЛЕКТРИЧНА
- ПРИНЦИПОВА
- Листов
- Инв.№ подл.
- Утв.
- Н.контр.
- Нач.сект.
- Копировал
- Формат  A4
- (in symbol M20-9770242) Коло; Конт.

## Sheet Sheet5.SchDoc
size 420 x 297 mm; CheckedBy: Бондарчук ПС; Author: Ільницька ЛЛ; CompanyName: ТОВ "Радіонікс"; SheetNumber: 1; SheetTotal: 1; PageSetup: Record=PageOptions|CenterHorizontal=True|CenterVertical=True|PrintScale=0.66|XCorrection=1.00|YCorrection=1.00|PrintKind=1|BorderSize=5000000|LeftOffset=0|BottomOffset=0|Orientation=2|PaperLength=2970|PaperWidth=2100|Scale=100|PaperSource=7|PrintQuality=600|MediaType=1|DitherType=10|PrintScaleMode=1|PaperKind=A4|PaperIndex=9; DecimalNumber: АЧАД.441465.ххх Э3; HeadOfSector: Нач. сектора; MainDevice: Перв.примен.; Name: СТЕНД КОНТРОЛЯ ПРИВОДА; DecimalNumber_MIRROR: ххх.564144.ДАЧА
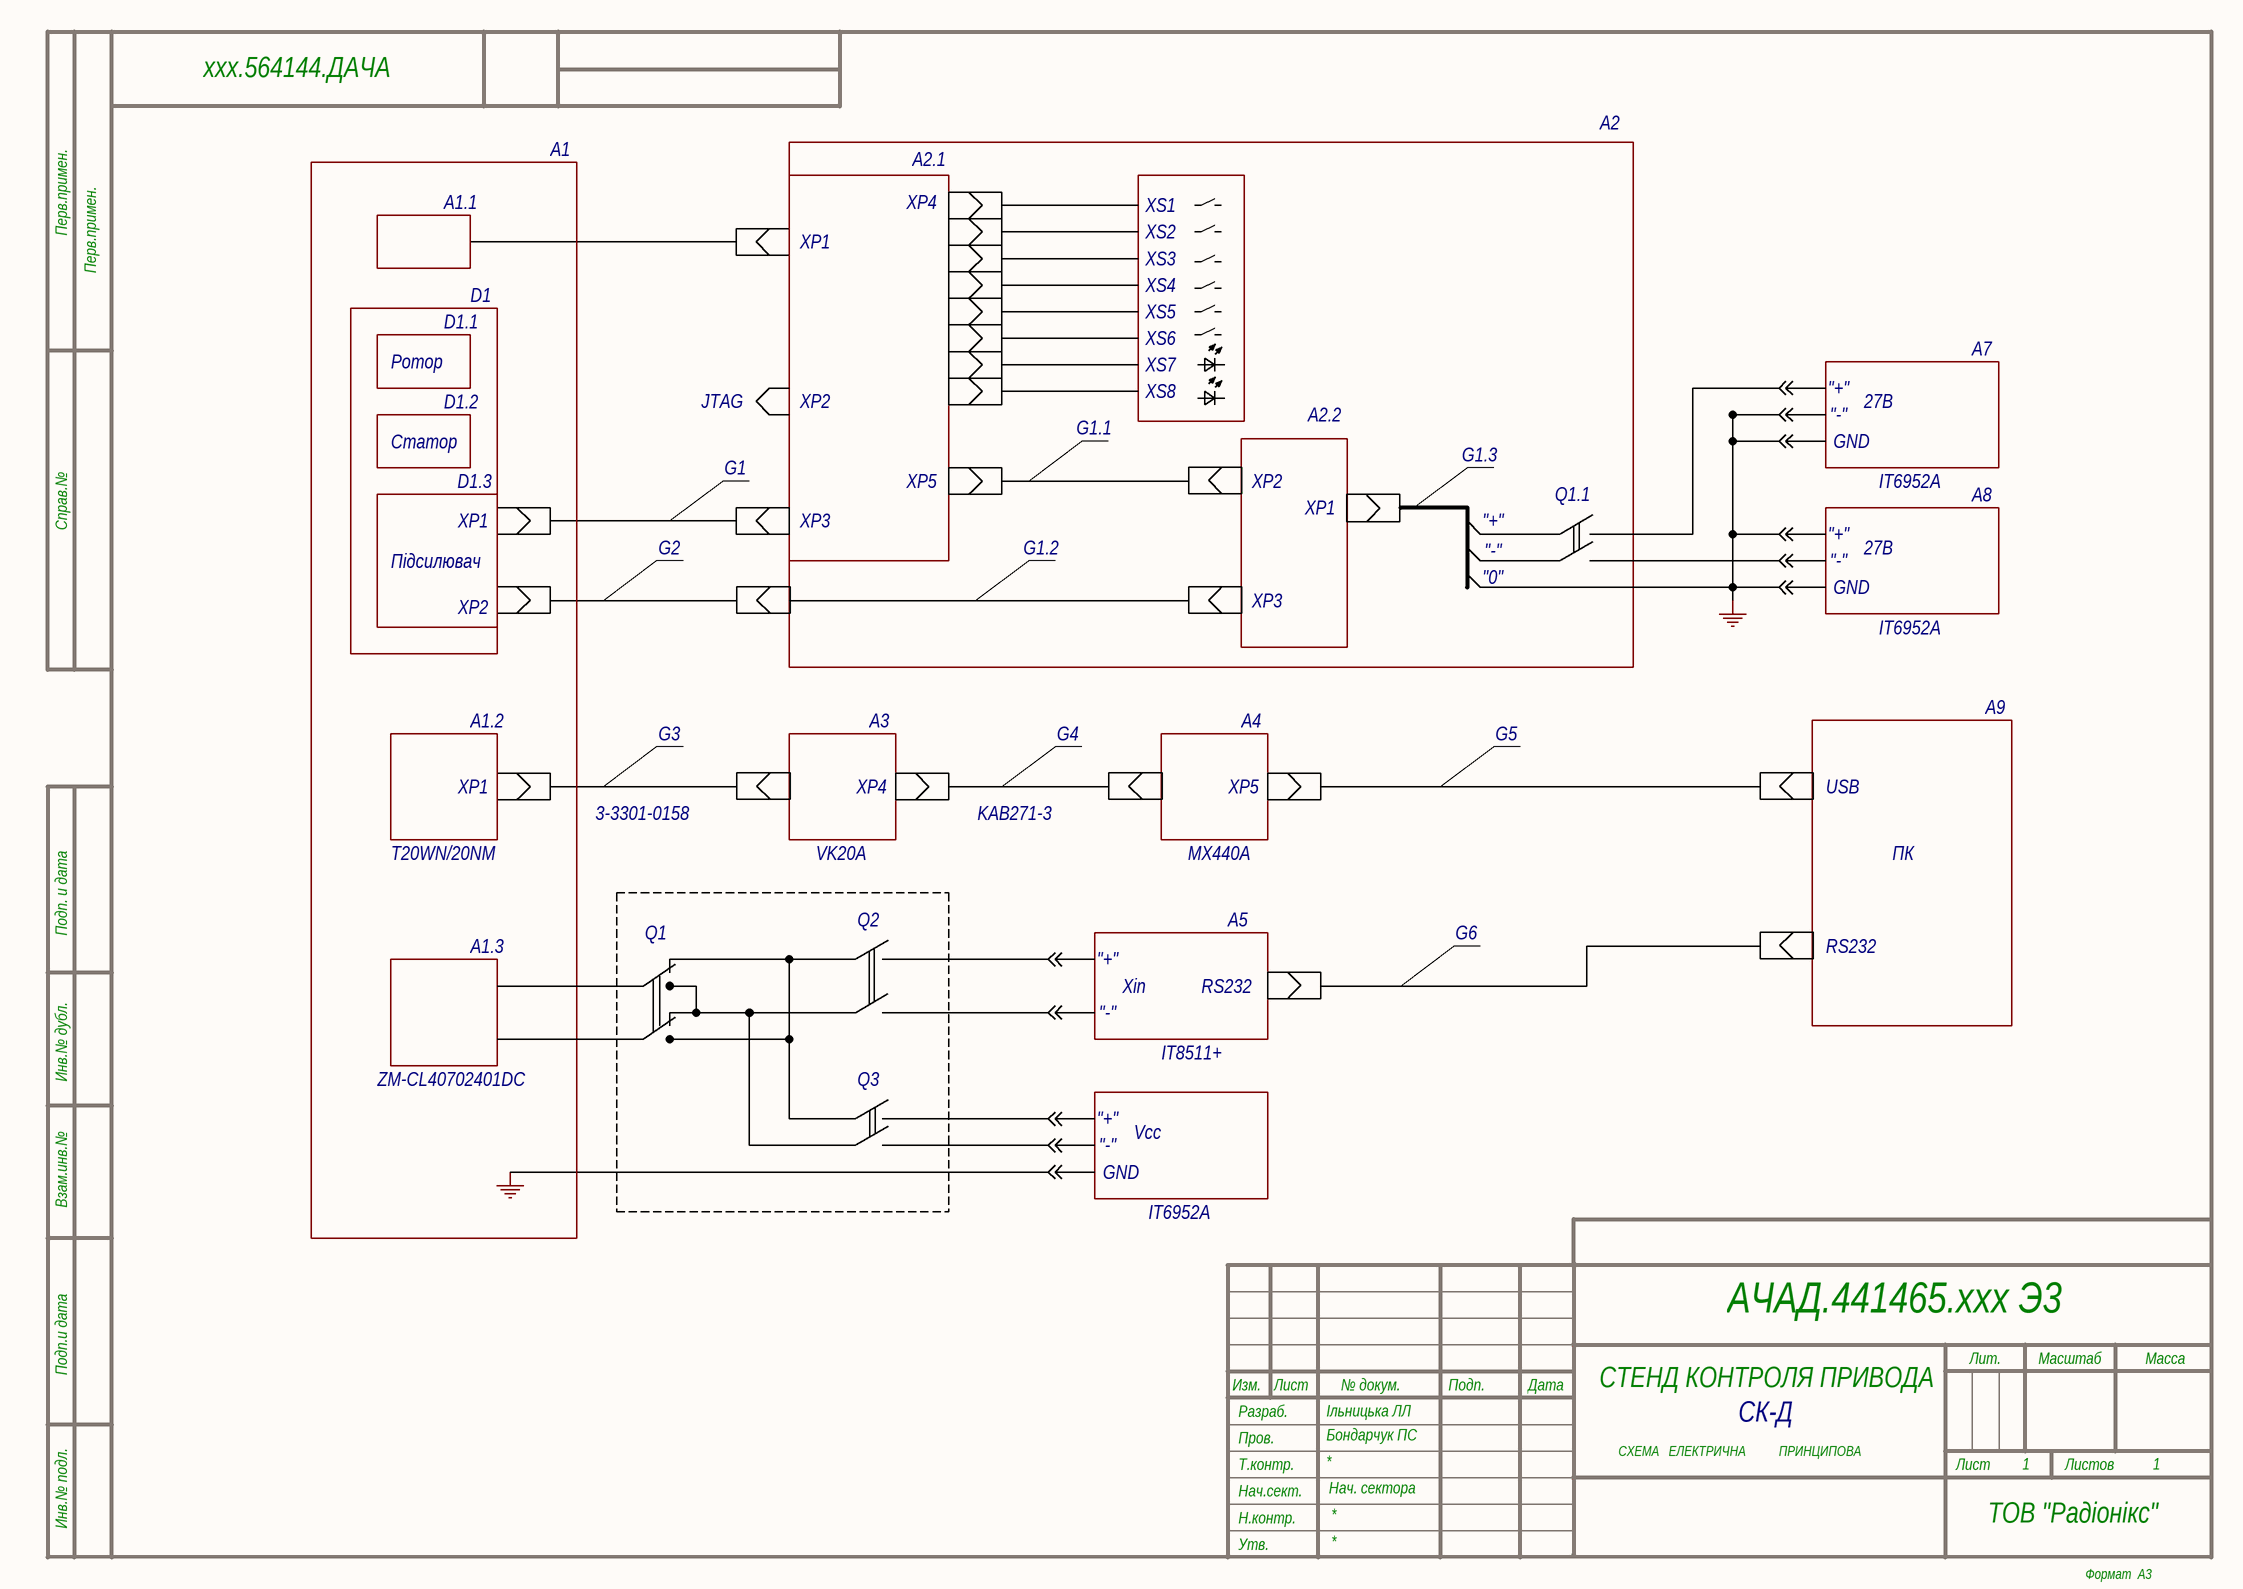
[diagram p5: Sheet5.SchDoc]

### Notes on the sheet
- А1
- А2.1
- А2
- А1.1
- XP1
- XP4
- XS1
- XS2
- XS3
- D1.1
- D1
- XS4
- XS5
- Ротор
- JTAG
- XP2
- XS6
- XS7
- XS8
- "+"
- 27В
- А7
- Статор
- D1.2
- G1
- G1.1
- А2.2
- G1.3
- "-"
- GND
- D1.3
- XP3
- XP5
- Q1.1
- IT6952A
- А8
- Підсилювач
- G2
- G1.2
- "0"
- А1.2
- G3
- А3
- G4
- А4
- G5
- А9
- USB
- T20WN/20NM
- 3-3301-0158
- VK20A
- KAB271-3
- MX440A
- ПК
- Q1
- Q2
- А5
- G6
- А1.3
- Xin
- RS232
- IT8511+
- ZM-CL40702401DC
- Q3
- Vcc
- СК-Д
- Labels drawn without touching a wire or pin: GND
- Перв.примен.
- Справ.№
- Подп. и дата
- Инв.№ дубл.
- Взам.инв.№
- Подп.и дата
- Разраб.
- Изм.
- Лист
- № докум.
- Подп.
- Дата
- Лит.
- Масштаб
- Масса
- Т.контр.
- Пров.
- СХЕМА   ЕЛЕКТРИЧНА
- ПРИНЦИПОВА
- Листов
- Инв.№ подл.
- Утв.
- Н.контр.
- Нач.сект.
- Формат  A3

## Sheet ACR_2_Sheet7.SchDoc
size 209 x 297 mm; PageSetup: Record=PageOptions|CenterHorizontal=True|CenterVertical=True|PrintScale=0.94|XCorrection=1.00|YCorrection=1.00|PrintKind=1|BorderSize=5000000|LeftOffset=0|BottomOffset=0|Orientation=1|PaperLength=1000|PaperWidth=1000|Scale=100|PaperSource=7|PrintQuality=-4|MediaType=1|DitherType=10|PrintScaleMode=1|PaperKind=A4; DecimalNumber: Децимальный номер; HeadOfSector: Нач. сектора; MainDevice: Перв.примен.; Name: Наименование
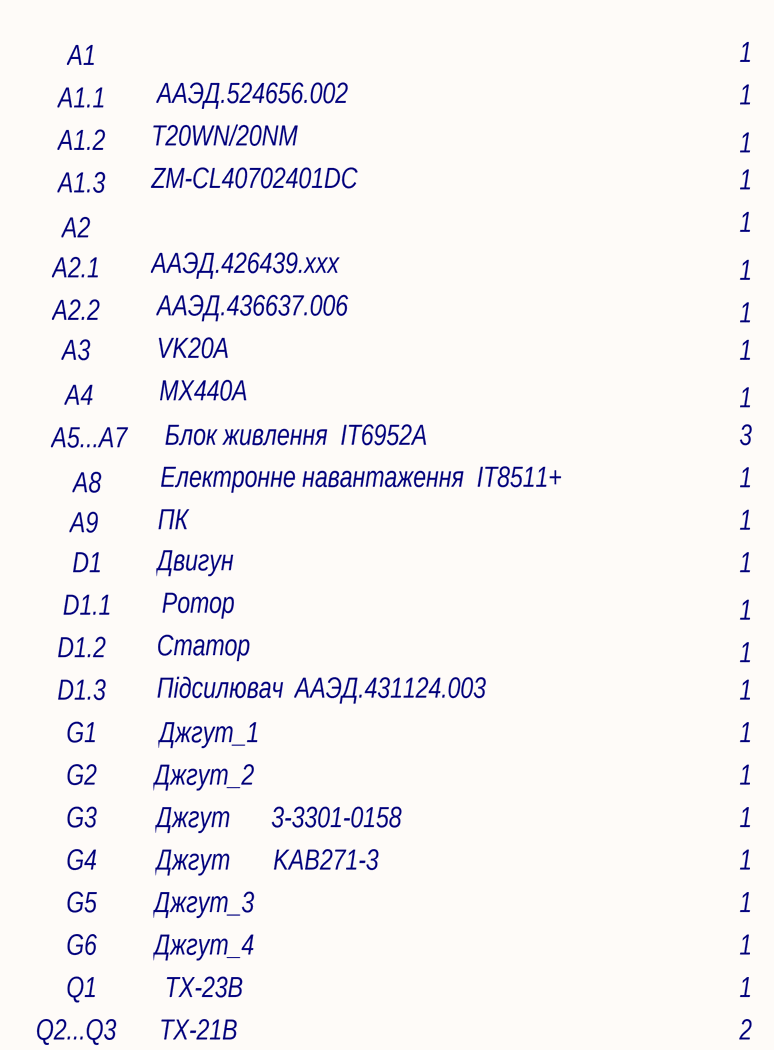
[diagram p6: ACR_2_Sheet7.SchDoc]

### Notes on the sheet
- А1
- А1.1
- ААЭД.524656.002
- 1
- А1.2
- А1.3
- T20WN/20NM
- А2
- ZM-CL40702401DC
- А2.1
- А2.2
- ААЭД.426439.ххх
- А3
- ААЭД.436637.006
- VK20A
- А4
- А5...A7
- MX440A
- Блок живлення  IT6952A
- 3
- A9
- A8
- ПК
- Електронне навантаження  IT8511+
- D1
- Двигун
- D1.2
- D1.1
- Ротор
- D1.3
- Статор
- Підсилювач
- ААЭД.431124.003
- G1
- G2
- Джгут_2
- Джгут_1
- G3
- G4
- Джгут
- KAB271-3
- 3-3301-0158
- G5
- Джгут_3
- Q1
- G6
- ТХ-23В
- Джгут_4
- Q2...Q3
- ТХ-21В
- 2
- Поз.
- обозна-
- чение
- Наименование
- Кол.
- Примечание
- Перв.примен.
- Справ.№
- Подп. и дата
- Инв.№ дубл.
- Взам.инв.№
- Подп.и дата
- Изм.
- Лист
- № докум.
- Подп.
- Дата
- Разраб.
- Пров.
- Лит.
- Листов
- Инв.№ подл.
- Утв.
- Н.контр.
- ПЕРЕЛІК ЕЛЕМЕНТІВ
- Копировал
- Формат  A4

## Nets that join several sheets
+1.2V: Sheet2 (37 pins), Sheet4 (C92.2 R75.1)
+2.5V: Sheet2 (8 pins), Sheet4 (R73.1)
+3.3V: Sheet1 (9 pins), Sheet2 (39 pins), Sheet3 (14 pins), Sheet4 (C91.2 R74.1)
+5V: Sheet1 (C2.2 C3.2 DA1.6 DA1.43), Sheet3 (7 pins), Sheet4 (16 pins)
+12V: Sheet1 (C9.1 DA2.3 R6.1), Sheet4 (C80.1 C83.2 PX2.5 PX2.10)
GND: Sheet1 (20 pins), Sheet2 (61 pins), Sheet3 (34 pins), Sheet4 (30 pins)
PV_EN: Sheet2 (DD3.129), Sheet4 (PX2.9)
A_0: Sheet1 (DA1.36), Sheet2 (DD3.4)
A_1: Sheet1 (DA1.37), Sheet2 (DD3.7)
ADC_CLK: Sheet2 (DD3.30), Sheet3 (DA4.8)
ADC_CNV: Sheet2 (DD3.28), Sheet3 (DA4.6 DA4.9)
ADC_SDO: Sheet2 (DD3.31), Sheet3 (DA4.7)
~{CS}: Sheet1 (DA1.2), Sheet2 (DD3.87)
CLK_OUT: Sheet1 (R3.1), Sheet2 (DD3.137)
D0: Sheet1 (DA1.28), Sheet2 (DD3.58)
D1: Sheet1 (DA1.27), Sheet2 (DD3.59)
D2: Sheet1 (DA1.26), Sheet2 (DD3.60)
D3: Sheet1 (DA1.25), Sheet2 (DD3.64)
D4: Sheet1 (DA1.24), Sheet2 (DD3.65)
D5: Sheet1 (DA1.23), Sheet2 (DD3.66)
D6: Sheet1 (DA1.22), Sheet2 (DD3.67)
D7: Sheet1 (DA1.21), Sheet2 (DD3.68)
D8: Sheet1 (DA1.20), Sheet2 (DD3.69)
D9: Sheet1 (DA1.17), Sheet2 (DD3.71)
D10: Sheet1 (DA1.16), Sheet2 (DD3.72)
D11: Sheet1 (DA1.15), Sheet2 (DD3.76)
D12: Sheet1 (DA1.14), Sheet2 (DD3.77)
D13: Sheet1 (DA1.13), Sheet2 (DD3.79)
D14: Sheet1 (DA1.12), Sheet2 (DD3.80)
D15: Sheet1 (DA1.11), Sheet2 (DD3.83)
DD0: Sheet1 (R10.1), Sheet2 (DD3.39)
DD1: Sheet1 (R17.1), Sheet2 (DD3.42)
DD2: Sheet1 (R11.1), Sheet2 (DD3.43)
DD3: Sheet1 (R18.1), Sheet2 (DD3.44)
DD4: Sheet1 (R12.1), Sheet2 (DD3.46)
DD5: Sheet1 (R19.1), Sheet2 (DD3.49)
DD6: Sheet1 (R13.1), Sheet2 (DD3.50)
DD7: Sheet1 (R20.1), Sheet2 (DD3.51)
Drv_DIR: Sheet2 (DD3.143), Sheet3 (DD6.5)
Drv_DIS: Sheet2 (DD3.144), Sheet3 (DD7.5)
Drv_PWM: Sheet2 (DD3.142), Sheet3 (DD5.5)
E: Sheet1 (R15.1), Sheet2 (DD3.100)
R/W: Sheet1 (R21.1), Sheet2 (DD3.99)
~{RD}: Sheet1 (DA1.3), Sheet2 (DD3.86)
~{RESET}: Sheet1 (DA1.33), Sheet2 (DD3.133)
~{RW}: Sheet1 (DA1.4), Sheet2 (DD3.85)
RS: Sheet1 (R14.1), Sheet2 (DD3.98)
~{SEMPLE}: Sheet1 (DA1.10), Sheet2 (DD3.132)
~{SOE}: Sheet1 (DA1.9), Sheet2 (DD3.135)